# Altium schematic sheet Relay.SchDoc
size A4; SheetNumber: 1; SheetTotal: 1; SPICEModelCacheOJFIWINB: <root> / <DocumentId>OJFIWINB</DocumentId> / </root>
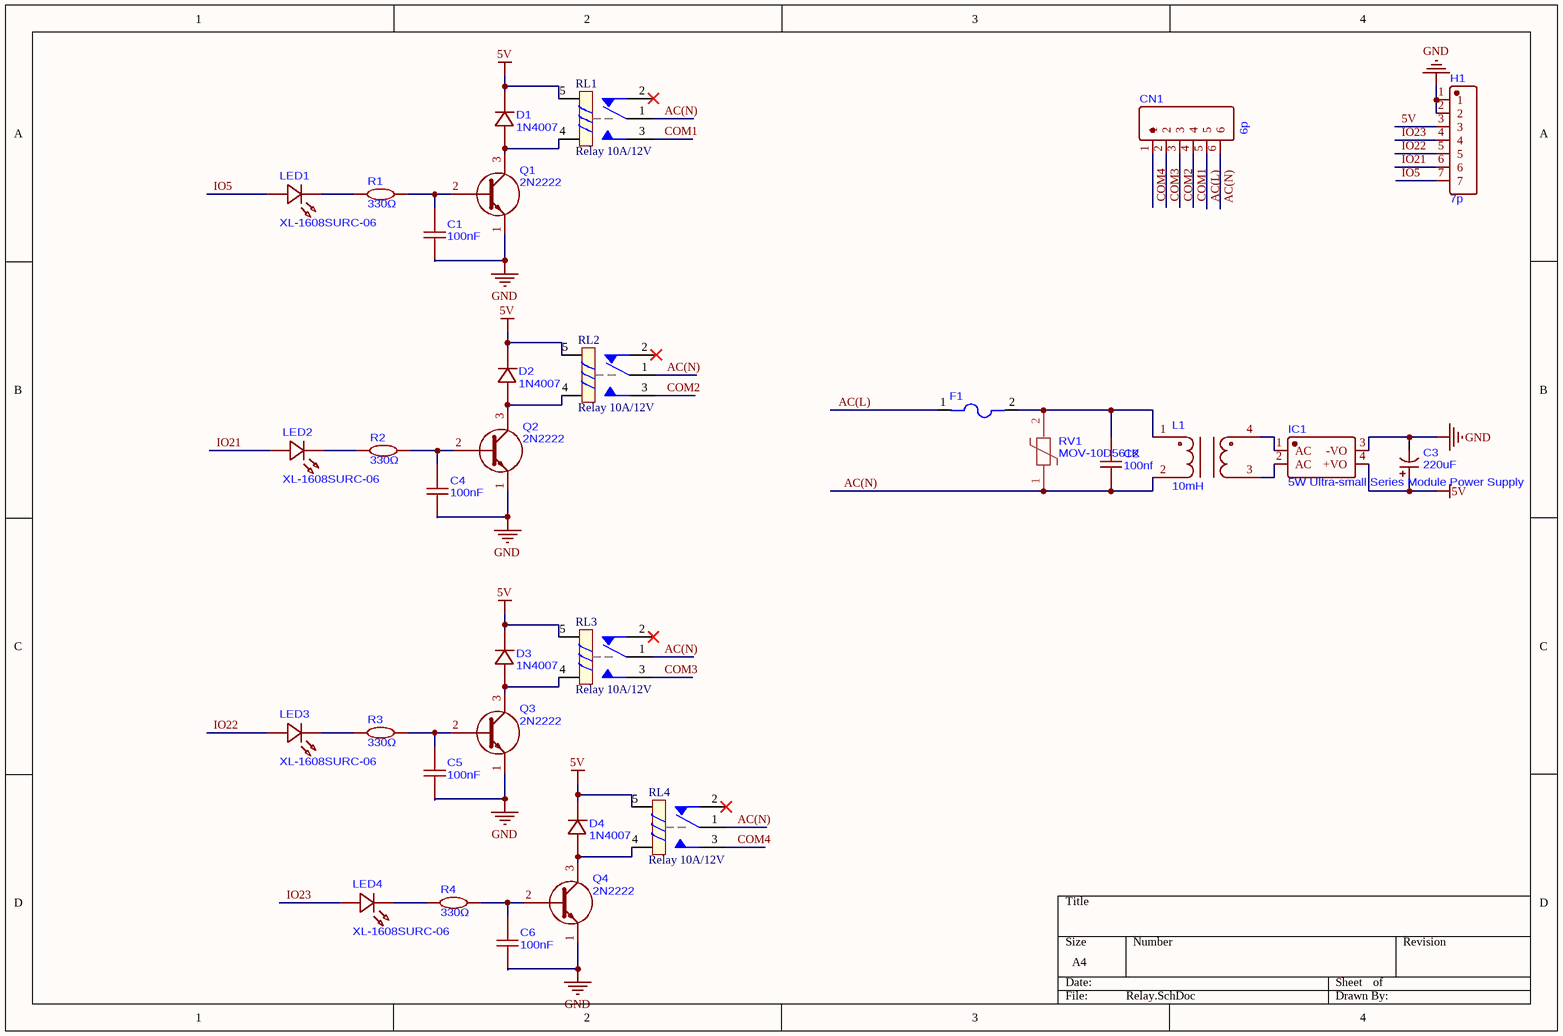
[diagram p0: Relay.SchDoc]

## Parts
C1  100nF  [C0603]
C2  100nf  [CAP-TH_L10.0-W5.0-P7.50-D0.6]
C3  220uF  [CAP-SMD_BD6.3-L6.6-W6.6-FD]
C4  100nF  [C0603]
C5  100nF  [C0603]
C6  100nF  [C0603]
CN1  6p  [CONN-TH_6P-MX128-5.08-GN01-06P-CU-Y-A]
D1  1N4007  [DO-41_BD2.4-L4.7-P8.70-D0.9-RD]
D2  1N4007  [DO-41_BD2.4-L4.7-P8.70-D0.9-RD]
D3  1N4007  [DO-41_BD2.4-L4.7-P8.70-D0.9-RD]
D4  1N4007  [DO-41_BD2.4-L4.7-P8.70-D0.9-RD]
F1  FUSE BRD MNT 1A 250VAC/VDC 2410  [F2410]  (value not drawn)
H1  7p  [CONN-TH_7P-P2.54_XH2.54-7P]
IC1  5W Ultra-small Series Module Power Supply  [PWRM-TH_HLK-5M05]
L1  10mH  [FILTER-TH_UU9.8Y-10MH]
LED1  XL-1608SURC-06  [LED0603-RD_RED]
LED2  XL-1608SURC-06  [LED0603-RD_RED]
LED3  XL-1608SURC-06  [LED0603-RD_RED]
LED4  XL-1608SURC-06  [LED0603-RD_RED]
Q1  2N2222  [2N2222]
Q2  2N2222  [2N2222]
Q3  2N2222  [2N2222]
Q4  2N2222  [2N2222]
R1  330Ω  [R0603]
R2  330Ω  [R0603]
R3  330Ω  [R0603]
R4  330Ω  [R0603]
RL1  Relay 10A/12V  [RL_10A_5V]
RL2  Relay 10A/12V  [RL_10A_5V]
RL3  Relay 10A/12V  [RL_10A_5V]
RL4  Relay 10A/12V  [RL_10A_5V]
RV1  MOV-10D561K  [MOV10D561K]

## Nets
5V: C3.1 D1.1(K) D2.1(K) D3.1(K) D4.1(K) H1.3 IC1.4(+VO) RL1.5 RL2.5 RL3.5 RL4.5
GND: C1.1 C3.2 C4.1 C5.1 C6.1 H1.1 H1.2 IC1.3(-VO) Q1.1 Q2.1 Q3.1 Q4.1
AC(L): CN1.5 F1.1
AC(N): C2.2 CN1.6 L1.2 RL1.1 RL2.1 RL3.1 RL4.1 RV1.1
COM1: CN1.4 RL1.3
COM2: CN1.3 RL2.3
COM3: CN1.2 RL3.3
COM4: CN1.1 RL4.3
IO5: H1.7 LED1.2(A)
IO21: H1.6 LED2.2(A)
IO22: H1.5 LED3.2(A)
IO23: H1.4 LED4.2(A)
NetC1_2: C1.2 Q1.2 R1.2
NetC2_1: C2.1 F1.2 L1.1 RV1.2
NetC4_2: C4.2 Q2.2 R2.2
NetC5_2: C5.2 Q3.2 R3.2
NetC6_2: C6.2 Q4.2 R4.2
NetD1_2: D1.2(A) Q1.3 RL1.4
NetD2_2: D2.2(A) Q2.3 RL2.4
NetD3_2: D3.2(A) Q3.3 RL3.4
NetD4_2: D4.2(A) Q4.3 RL4.4
NetIC1_1: IC1.1(AC) L1.4
NetIC1_2: IC1.2(AC) L1.3
NetLED1_1: LED1.1(K) R1.1
NetLED2_1: LED2.1(K) R2.1
NetLED3_1: LED3.1(K) R3.1
NetLED4_1: LED4.1(K) R4.1

Not connected (* = marked no-connect by the designer): RL1 2*; RL2 2*; RL3 2*; RL4 2*

## Library data of the parts
C1 C4-C6 = CC0603KRX7R9BB104: 50V 100nF X7R ±10% 0603 Ceramic Capacitors ROHS
C2 = 100nF: 275V 100nF X2 ±10% Through Hole,P=7.5mm Ceramic Capacitors ROHS
C3 = RVT220UF10V67RV0037
CN1 = MX128-5.08-GN01-06P-CU-Y-A: 1x6P 12~24 10A Green -40℃~+105℃ 300V Through Hole 5.08mm 6 1 Through Hole,P=5.08mm Wire to Board ROHS
D1-D4 = 1N4007: 30A 1kV 1.1V@1A 1A DO-41 Single Diodes ROHS
F1 = JFC2410-1100TS: 50A Surface Mount Fuse 1A 2410 Fuses ROHS
H1 = WAFER-XH2.54-7PZZ: XH 1x7P 7P Tin -25℃~+85℃ White 2.5mm 250V 7 2A 1 Through Hole Through Hole,P=2.5mm Headers, Male Pins ROHS; System: connector
IC1 = HLK-5M05: AC/DC-DC DIP,38x23mm AC DC Converters ROHS
L1 = UU9.8Y-10MH: 10mH@1kHz 1.2Ω 2 Through Hole Common Mode Chokes ROHS
LED1-LED4 = XL-1608SURC-06: 20mA 2.3V Red 50mW 0603 LED Indication - Discrete ROHS
Q1-Q4 = 2N2222A: 625mW 40V 40@500mA,10V 600mA NPN TO-92 Single Bipolar Transistors ROHS
R1-R4 = RC0603FR-07330RL: 100mW 330Ω 75V ±100ppm/℃ Thick Film Resistor ±1% 0603 Chip Resistor - Surface Mount ROHS
RL1-RL4 = Relay 1: Relay SPDT,10A - 5VDC 5 Pin; Value: Relay SPDT, 10A, 12V
RV1 = MOV-10D561K: 925V 460V 350V 560V Through Hole,P=7.5mm Varistors, MOVs ROHS